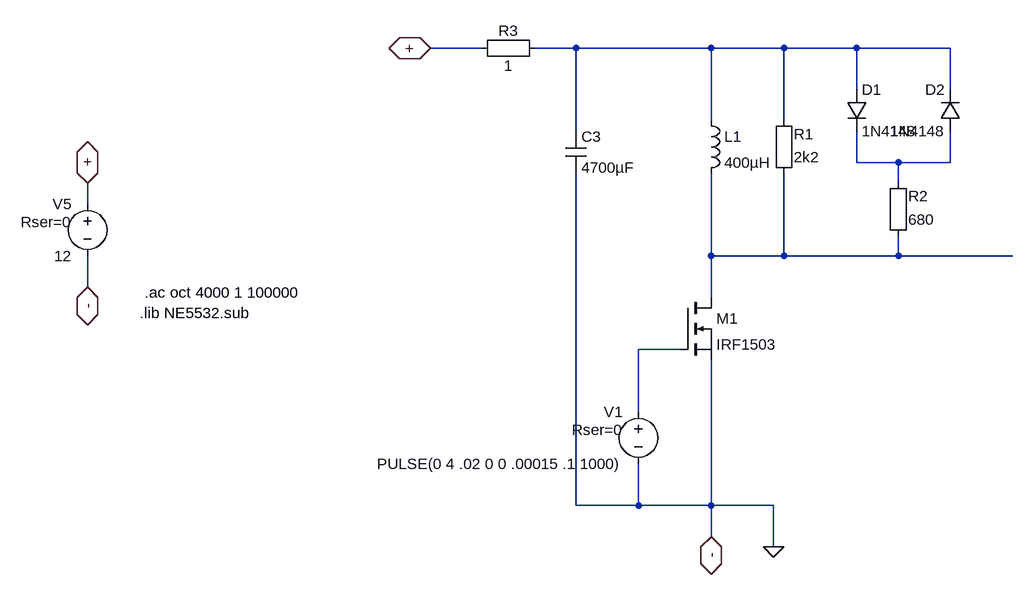
[diagram p0: schematic meat_haw_1.asc]
meat_haw_1.asc, the LTspice schematic file:
Version 4
SHEET 1 4676 1612
WIRE -112 -2464 -192 -2464
WIRE 32 -2464 -32 -2464
WIRE 240 -2464 32 -2464
WIRE 352 -2464 240 -2464
WIRE 464 -2464 352 -2464
WIRE 608 -2464 464 -2464
WIRE 464 -2400 464 -2464
WIRE 608 -2400 608 -2464
WIRE 240 -2352 240 -2464
WIRE 352 -2352 352 -2464
WIRE 32 -2336 32 -2464
WIRE 464 -2288 464 -2336
WIRE 528 -2288 464 -2288
WIRE 608 -2288 608 -2336
WIRE 608 -2288 528 -2288
WIRE 528 -2256 528 -2288
WIRE -720 -2224 -720 -2256
WIRE 240 -2144 240 -2272
WIRE 352 -2144 352 -2272
WIRE 352 -2144 240 -2144
WIRE 528 -2144 528 -2176
WIRE 528 -2144 352 -2144
WIRE 704 -2144 528 -2144
WIRE -720 -2096 -720 -2144
WIRE 240 -2080 240 -2144
WIRE 192 -2000 128 -2000
WIRE 128 -1904 128 -2000
WIRE 32 -1760 32 -2272
WIRE 128 -1760 128 -1824
WIRE 128 -1760 32 -1760
WIRE 240 -1760 240 -1984
WIRE 240 -1760 128 -1760
WIRE 336 -1760 240 -1760
WIRE 240 -1712 240 -1760
WIRE 336 -1696 336 -1760
FLAG -720 -2256 +
IOPIN -720 -2256 BiDir
FLAG -720 -2096 -
IOPIN -720 -2096 BiDir
FLAG 240 -1712 -
IOPIN 240 -1712 BiDir
FLAG -192 -2464 +
IOPIN -192 -2464 BiDir
FLAG 336 -1696 0
SYMBOL voltage -720 -2240 M0
WINDOW 123 0 0 Left 2
WINDOW 39 24 44 Left 2
SYMATTR SpiceLine Rser=0
SYMATTR InstName V5
SYMATTR Value 12
SYMBOL Misc\\EuropeanCap 16 -2336 R0
SYMATTR InstName C3
SYMATTR Value 4700µF
SYMATTR SpiceLine V=400 Irms=1 Rser=.32 Lser=0
SYMBOL ind 224 -2368 R0
SYMATTR InstName L1
SYMATTR Value 400µH
SYMBOL Misc\\EuropeanResistor 336 -2256 M180
WINDOW 0 31 76 Left 2
WINDOW 3 31 40 Left 2
SYMATTR InstName R1
SYMATTR Value 2k2
SYMBOL Misc\\EuropeanResistor 512 -2160 M180
WINDOW 0 31 76 Left 2
WINDOW 3 31 40 Left 2
SYMATTR InstName R2
SYMATTR Value 680
SYMBOL diode 448 -2400 R0
SYMATTR InstName D1
SYMATTR Value 1N4148
SYMBOL diode 624 -2336 R180
WINDOW 0 24 64 Left 2
WINDOW 3 24 0 Left 2
SYMATTR InstName D2
SYMATTR Value 1N4148
SYMBOL Misc\\EuropeanResistor -128 -2480 M90
WINDOW 0 5 56 VBottom 2
WINDOW 3 27 56 VTop 2
SYMATTR InstName R3
SYMATTR Value 1
SYMBOL nmos 192 -2080 R0
SYMATTR InstName M1
SYMATTR Value IRF1503
SYMBOL voltage 128 -1920 M0
WINDOW 123 0 0 Left 2
WINDOW 39 24 44 Left 2
SYMATTR SpiceLine Rser=0
SYMATTR InstName V1
SYMATTR Value PULSE(0 4 .02 0 0 .00015 .1 1000)
TEXT -632 -2088 Left 2 !.ac oct 4000 1 100000
TEXT -640 -2056 Left 2 !.lib NE5532.sub

The netlist it stands for:
* meat_haw_1.asc
V5 + 0 12 Rser=0
C3 N001 0 4700µF V=400 Irms=1 Rser=.32 Lser=0
L1 N001 N003 400µH
R1 N003 N001 2k2
R2 N003 N002 680
D1 N001 N002 1N4148
D2 N002 N001 1N4148
R3 + N001 1
M1 N003 N004 0 0 IRF1503
V1 N004 0 PULSE(0 4 .02 0 0 .00015 .1 1000) Rser=0
.model D D
.lib standard.dio
.model NMOS NMOS
.model PMOS PMOS
.lib standard.mos
.ac oct 4000 1 100000
.lib NE5532.sub
.backanno
.end